# EAGLE design MicroSD (EAGLE 6.3)
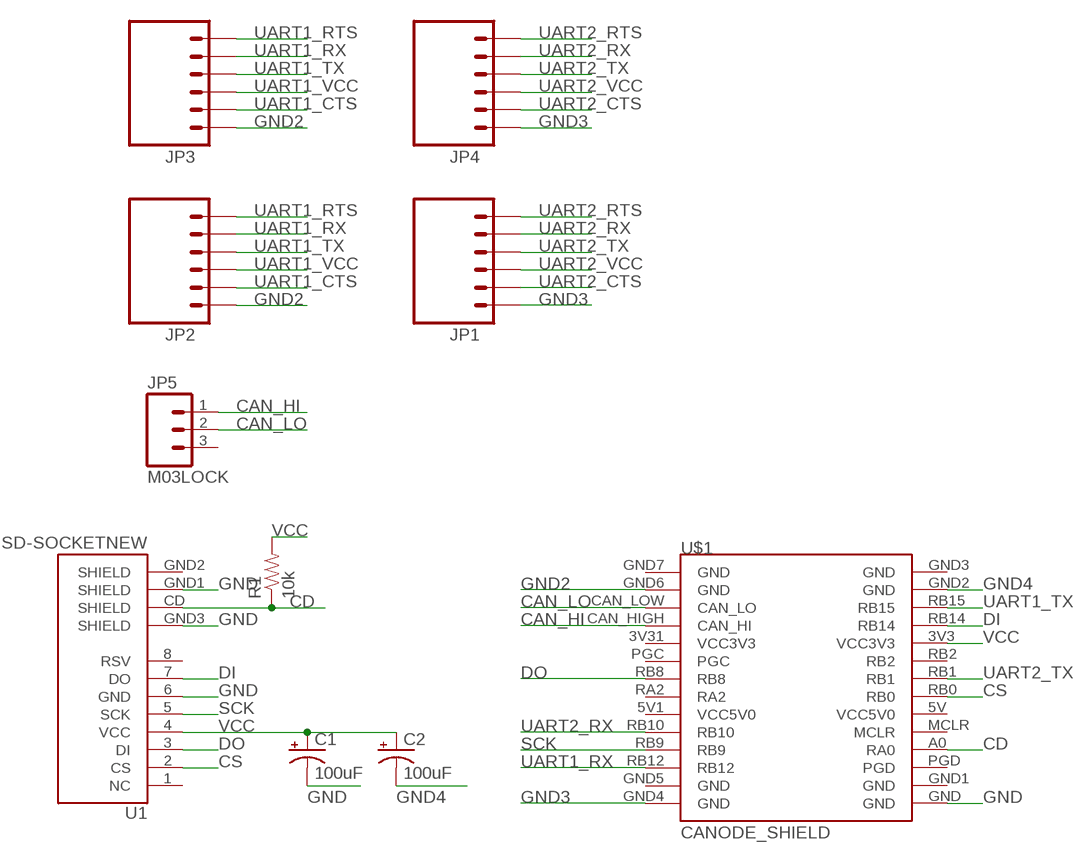
[diagram p0: schematic, sheet 1]

## Parts
C1  100uF  CAP_POLPTH1  [CPOL-RADIAL-100UF-25V]
C2  100uF  CAP_POLPTH1  [CPOL-RADIAL-100UF-25V]
JP1  M06LOCK  [1X06_LOCK]
JP2  M06LOCK  [1X06_LOCK]
JP3  M06LOCK  [1X06_LOCK]
JP4  M06LOCK  [1X06_LOCK]
JP5  M03LOCK  [1X03_LOCK]
R1  10k  RESISTOR0805-RES  [0805]
U1  USD-SOCKETNEW  [MICRO-SD-SOCKET-PP]
U$1  CANODE_SHIELD  [CANODE_SHIELD]

## Nets
CAN_HI [small]: JP5.1 U$1.CAN_HIGH(CAN_HI)
CAN_LO: JP5.2 U$1.CAN_LOW(CAN_LO)
CD: R1.1 U1.CD(SHIELD) U$1.A0(RA0)
CS [small]: U1.2(CS) U$1.RB0
DI [small]: U1.7(DO) U$1.RB14
DO: U1.3(DI) U$1.RB8
GND [power]: C1.2(-) U1.6(GND) U1.GND1(SHIELD) U1.GND3(SHIELD) U$1.GND
GND2 [power]: JP2.1 JP3.1 U$1.GND6(GND)
GND3: JP1.1 JP4.1 U$1.GND4(GND)
GND4 [power]: C2.2(-) U$1.GND2(GND)
SCK [small]: U1.5(SCK) U$1.RB9
UART1_CTS: JP2.2 JP3.2
UART1_RTS: JP2.6 JP3.6
UART1_RX [small]: JP2.5 JP3.5 U$1.RB12
UART1_TX [small]: JP2.4 JP3.4 U$1.RB15
UART1_VCC: JP2.3 JP3.3
UART2_CTS: JP1.2 JP4.2
UART2_RTS: JP1.6 JP4.6
UART2_RX [small]: JP1.5 JP4.5 U$1.RB10
UART2_TX [small]: JP1.4 JP4.4 U$1.RB1
UART2_VCC: JP1.3 JP4.3
VCC [power]: C1.1(+) C2.1(+) R1.2 U1.4(VCC) U$1.3V3(VCC3V3)
Unconnected: JP5.3 U1.1(NC) U1.8(RSV) U1.GND2(SHIELD) U$1.3V31(VCC3V3) U$1.5V1(VCC5V0) U$1.5V(VCC5V0) U$1.GND1(GND) U$1.GND3(GND) U$1.GND5(GND) U$1.GND7(GND) U$1.MCLR U$1.PGC U$1.PGD U$1.RA2 U$1.RB2

## Library data of the parts
C1 C2 = ASL:CAP_POL: Capacitor Polarized These are standard SMD and PTH capacitors. Normally 10uF, 47uF, and 100uF in electrolytic and tantalum varieties. Always verify the external diameter of the through hole cap, it varies with capacity, voltage, and manufacturer. The EIA devices should be standard.
JP1-JP4 = CMPE118lib:M06: Header 6 Standard 6-pin 0.1" header. Use with straight break away headers (SKU : PRT-00116), right angle break away headers (PRT-00553), swiss pins (PRT-00743), machine pins (PRT-00117), and female headers (PRT-00115). Molex polarized connector foot print use with SKU : PRT-08094 with associated crimp pins and housings. NOTES ON THE VARIANTS LOCK and LOCK_LONGPADS... This footprint was designed to help hold the alignment of a through-hole component (i.e. 6-pin header) while soldering it into place. You may notice that each hole has been shifted either up or down by 0.005 of an inch from it's more standard position (which is a perfectly straight line). This slight alteration caused the pins (the squares in the middle) to touch the edges of the holes. Because they are alternating, it causes a "brace" to hold the component in place. 0.005 has proven to be the perfect amount of "off-center" position when using our standard breakaway headers. Although looks a little odd when you look at the bare footprint, once you have a header in there, the alteration is very hard to notice. Also, if you push a header all the way into place, it is covered up entirely on the bottom side. This idea of altering the position of holes to aid alignment will be further integrated into the Sparkfun Library for other footprints. It can help hold any component with 3 or more connection pins.
JP5 = ASL:M03: Header 3 Standard 3-pin 0.1" header. Use with straight break away headers (SKU : PRT-00116), right angle break away headers (PRT-00553), swiss pins (PRT-00743), machine pins (PRT-00117), and female headers (PRT-00115). Molex polarized connector foot print use with SKU : PRT-08232 with associated crimp pins and housings.
R1 = ASL:RESISTOR: Resistor Basic schematic elements and footprints for 0603, 1206, and PTH resistors.
U1 = ASL:USD-SOCKET: microSD Socket Push-push type uSD socket. Schematic element and footprint production proven. Spark Fun Electronics SKU : PRT-00127. tDoc lines correctly indicate media card edge positions when inserting (unlocked, locked, depressed).
U$1 = ASL:CANODE_SHIELD: This part provides an outline of the CANode to facilitate developing shield boards. Note that this does not show the position of the mounting holes for the 4-40 screws, which should be .12" holes centered in the 4 circles in the corners.

## Net classes
0 default: width 0.406 mm
1 power: width 0.762 mm, clearance 0.254 mm to class 0, clearance 0.508 mm
2 small: width 0.203 mm

## Board
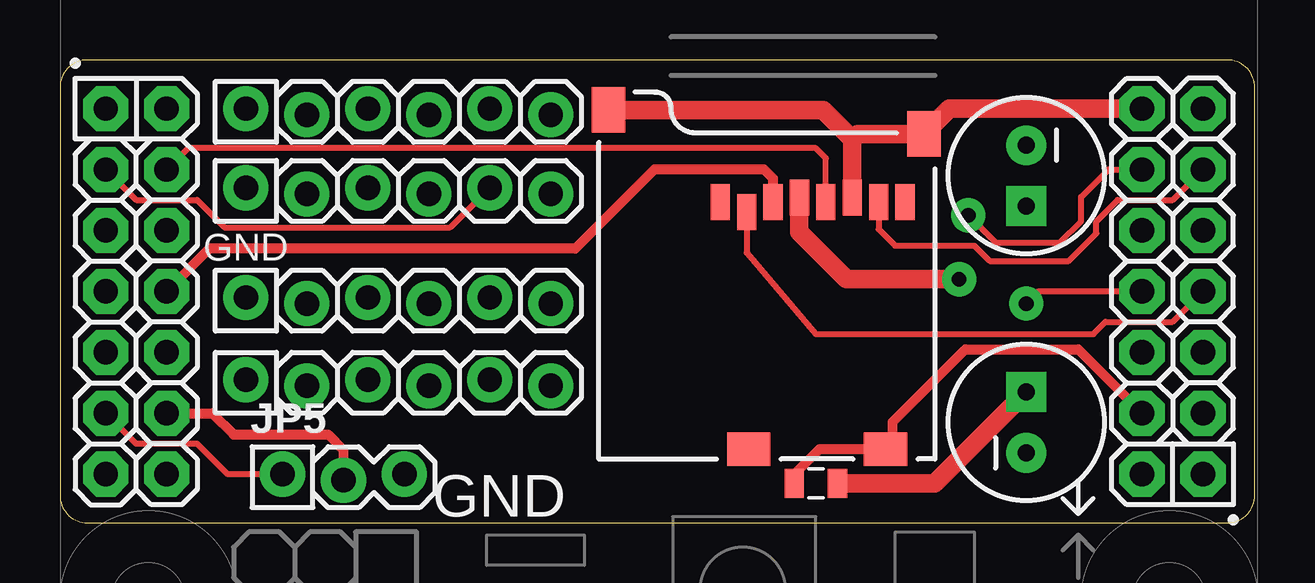
[diagram p1: board, top side]
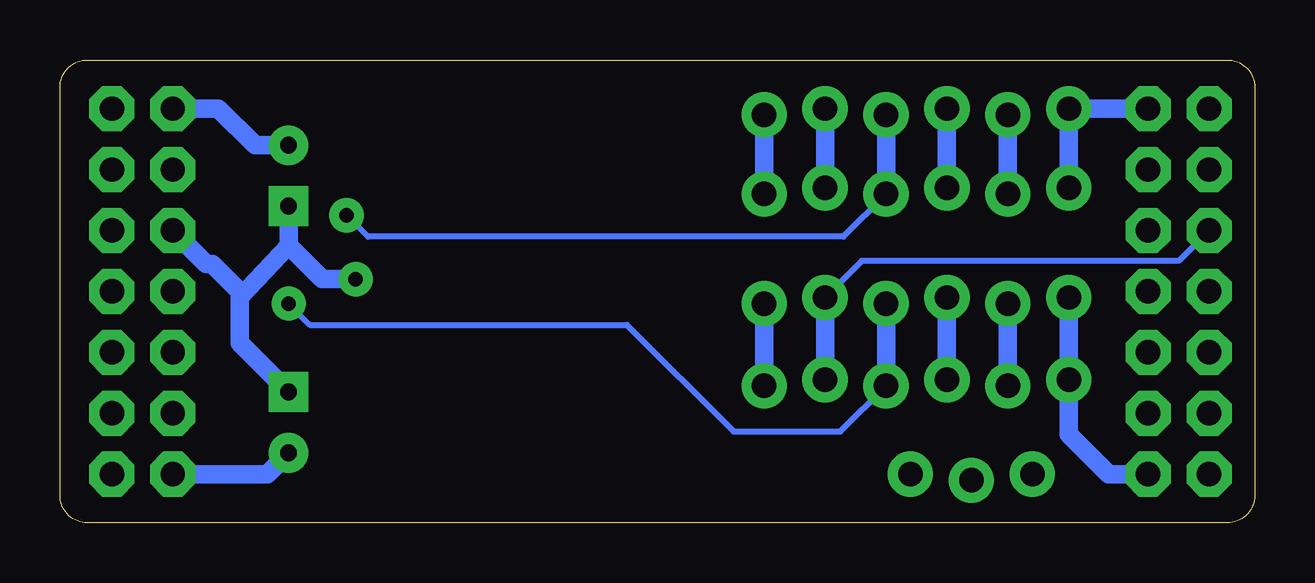
[diagram p2: board, bottom side, seen from below]

Size 49.78 x 19.3 mm. Coordinates in mm from the lower left corner, seen from the top.
Outline: 0,18.16 0,1.14 arc90 1.14,0 48.64,0 arc90 49.78,1.14 49.78,18.16 arc90 48.64,19.3 1.14,19.3 arc90 0,18.16
Copper layers (1*16): Top 0.035mm / dielectric 1.5mm / Bottom 0.035mm
Design rules "default": minimum track width 10mil, minimum drill 24mil, track to track 8mil, track to pad 8mil, pad to pad 8mil, via to via 8mil, smd to smd 8mil, copper to edge 40mil, drill to drill 8mil, minimum pad ring 10mil, minimum via ring 8mil, stop-mask expansion 4mil, vias tented up to drill 0mil, thermal gap 10mil

### Footprints (pad centres in the part's own frame; a part is rotated, then mirrored left to right if it is on the bottom)
CPOL-RADIAL-100UF-25V = drill 0.7 pad 1.651 square: 1 1.27,0 | drill 0.7 pad 1.651: 2 -1.27,0
1X06_LOCK = drill 1.016 pad 1.88: 1 0,0.127; 2 2.54,-0.127; 3 5.08,0.127; 4 7.62,-0.127; 5 10.16,0.127; 6 12.7,-0.127
1X03_LOCK = drill 1.016 pad 1.88: 1 0,0.127; 2 2.54,-0.127; 3 5.08,0.127
0805 = smd 0.8 x 1.2: 1 -0.9,0; 2 0.9,0
MICRO-SD-SOCKET-PP = smd 0.8 x 1.5: 1 -8.94,10.7; 2 -7.84,10.3; 3 -6.74,10.7; 4 -5.64,10.9; 5 -4.54,10.7; 6 -3.44,10.9; 7 -2.34,10.7; 8 -1.24,10.7 | smd 1.8 x 1.4: CD -2.05,0.4; GND2 -7.75,0.4 | smd 1.4 x 1.9: GND1 -13.6,14.55; GND3 -0.45,13.55
CANODE_SHIELD = drill 1.016 pad 1.88 octagon: 3V3 45.085,19.05; 3V31 4.445,13.97; 5V 45.085,13.97; 5V1 4.445,19.05; A0 45.085,11.43; CAN_HIGH 1.905,11.43; CAN_LOW 4.445,11.43; GND 45.085,24.13; GND1 47.625,24.13; GND2 45.085,8.89; GND3 47.625,8.89; GND4 4.445,8.89; GND5 1.905,8.89; GND6 4.445,24.13; GND7 1.905,24.13; MCLR 47.625,13.97; PGC 1.905,13.97; PGD 47.625,11.43; RA2 1.905,16.51; RB0 47.625,16.51; RB1 45.085,16.51; RB2 47.625,19.05; RB8 4.445,16.51; RB9 4.445,21.59; RB10 1.905,19.05; RB12 1.905,21.59; RB14 47.625,21.59; RB15 45.085,21.59

### Placement (x,y rotation side)
C1  40.26,14.48 270 top
C2  40.26,4.19 90 top
JP1  7.75,9.27 0 top
JP2  7.75,17.14 0 top
JP3  7.75,13.84 0 top
JP4  7.75,5.84 0 top
JP5  9.27,1.91 0 top
R1  31.5,1.65 0 top
U1  36.45,2.67 0 top
U$1  0,-6.86 0 top

### Tracks (layer width: path | path; a pad name or v marks a point on that pad's centre or on a via)
CAN_HI
  Top 0.254: JP5.1 6.99,2.03 5.71,3.3 3.17,3.3 U$1.CAN_HIGH
CAN_LO
  Top 0.406: U$1.CAN_LOW 6.35,4.57 7.24,3.68 11.18,3.68 11.81,3.05 JP5.2
CD
  Top 0.406: U$1.A0 42.42,7.24 37.72,7.24 34.69,4.21 34.69,3.58 U1.CD 31.64,3.07 30.73,2.16 30.73,1.79 R1.1
CS
  Top 0.254: U1.2 28.61,11.27 31.5,7.87 43.05,7.87 43.56,8.38 46.35,8.38 U$1.RB0
DI
  Top 0.254: U1.7 34.11,12.25 34.8,11.56 38.1,11.56 38.73,10.92 42.04,10.92 43.18,12.06 43.18,12.57 44.07,13.46 46.35,13.46 U$1.RB14
DO
  Top 0.406: U1.3 29.71,14.36 29.34,14.73 24.77,14.73 21.46,11.43 6.22,11.43 U$1.RB8
GND
  Top 0.762: U1.GND1 31.8,17.22 33.02,16 | U1.6 33.02,14.97 33.02,16 | 33.02,16 33.23,16.22 U1.GND3 37.05,17.27 U$1.GND
  Bottom 0.762: C1.2 41.66,15.75 43.18,17.27 U$1.GND
GND2
  Bottom 0.762: JP3.1 JP2.1 U$1.GND6
GND3
  Bottom 0.762: JP1.1 JP4.1 7.75,3.68 6.1,2.03 U$1.GND4
GND4
  Bottom 0.762: C2.2 41.15,2.03 U$1.GND2
SCK
  Top 0.254: U1.5 31.91,15.21 31.5,15.62 5.33,15.62 U$1.RB9
UART1_CTS
  Bottom 0.762: JP2.2 JP3.2
UART1_RTS
  Bottom 0.762: JP2.6 JP3.6
UART1_RX
  Top 0.254: U$1.RB12 3.17,13.46 5.71,13.46 6.86,12.32 16.26,12.32 JP3.5
  Bottom 0.762: JP2.5 JP3.5
UART1_TX  (via drill 0.61 pad 1.42)
  Top 0.254: v37.85,12.83 38.99,11.68 41.66,11.68 42.55,12.57 42.55,13.59 43.69,14.73 U$1.RB15
  Bottom 0.254: JP3.4 17.14,11.94 36.96,11.94 v37.85,12.83
  Bottom 0.762: JP2.4 JP3.4
UART1_VCC
  Bottom 0.762: JP2.3 JP3.3
UART2_CTS
  Bottom 0.762: JP1.2 JP4.2
UART2_RTS
  Bottom 0.762: JP4.6 JP1.6
UART2_RX
  Bottom 0.254: JP1.5 16.38,10.92 3.17,10.92 U$1.RB10
  Bottom 0.762: JP1.5 JP4.5
UART2_TX  (via drill 0.61 pad 1.42)
  Top 0.254: U$1.RB1 40.77,9.65 v40.26,9.14
  Bottom 0.254: JP4.4 17.27,3.81 21.72,3.81 26.16,8.25 39.37,8.25 v40.26,9.14
  Bottom 0.762: JP1.4 JP4.4
UART2_VCC
  Bottom 0.762: JP1.3 JP4.3
VCC  (via drill 0.61 pad 1.42)
  Top 0.762: U1.4 30.81,12.12 32.77,10.16 v37.47,10.16 | R1.2 36.45,1.65 C2.1
  Bottom 0.762: 42.29,9.4 40.26,11.56 | 40.26,11.56 C1.1 | C2.1 42.29,7.49 42.29,9.4 | v37.47,10.16 38.86,10.16 40.26,11.56 | 42.29,9.4 42.29,9.65 43.43,10.79 43.69,10.79 U$1.3V3

### Text on the board
tNames: GND | GND